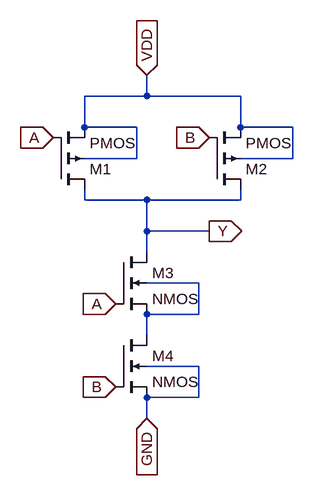
[diagram p0: schematic NAND_SYM.asc]
NAND_SYM.asc, the LTspice schematic file:
Version 4
SHEET 1 880 680
WIRE 208 -48 208 -80
WIRE 208 -48 112 -48
WIRE 352 -48 208 -48
WIRE 112 0 112 -48
WIRE 192 0 112 0
WIRE 352 0 352 -48
WIRE 432 0 352 0
WIRE 192 48 192 0
WIRE 192 48 112 48
WIRE 432 48 432 0
WIRE 432 48 352 48
WIRE 112 112 112 96
WIRE 208 112 112 112
WIRE 352 112 352 96
WIRE 352 112 208 112
WIRE 208 160 208 112
WIRE 304 160 208 160
WIRE 208 192 208 160
WIRE 288 240 208 240
WIRE 288 288 288 240
WIRE 288 288 208 288
WIRE 208 320 208 288
WIRE 288 368 208 368
WIRE 288 416 288 368
WIRE 288 416 208 416
WIRE 208 448 208 416
FLAG 208 -80 VDD
IOPIN 208 -80 In
FLAG 64 16 A
IOPIN 64 16 In
FLAG 160 272 A
IOPIN 160 272 In
FLAG 160 400 B
IOPIN 160 400 In
FLAG 304 16 B
IOPIN 304 16 In
FLAG 208 448 GND
IOPIN 208 448 In
FLAG 304 160 Y
IOPIN 304 160 Out
SYMBOL pmos4 64 96 M180
SYMATTR InstName M1
SYMBOL pmos4 304 96 M180
SYMATTR InstName M2
SYMBOL nmos4 160 192 R0
SYMATTR InstName M3
SYMBOL nmos4 160 320 R0
SYMATTR InstName M4

The netlist it stands for:
* NAND_SYM.asc
M1 Y A VDD VDD PMOS
M2 Y B VDD VDD PMOS
M3 Y A N001 N001 NMOS
M4 N001 B GND GND NMOS
.model NMOS NMOS
.model PMOS PMOS
.lib standard.mos
.backanno
.end